# Altium schematic sheet TopAdapter.SchDoc
size A4
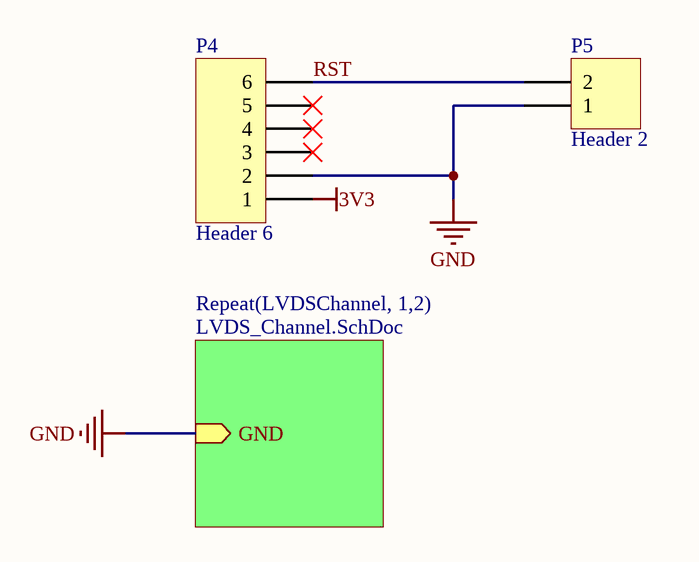
[diagram p0: TopAdapter.SchDoc]

## Parts
P4  Header 6  [HDR1X6]
P5  Header 2  [HDR1X2]

## Sub-sheets
Repeat(LVDSChannel, 1,2) = LVDS_Channel.SchDoc: GND (in)

## Nets
3V3: P4.1
GND: P4.2 P5.1 ; sheet Repeat(LVDSChannel, 1,2)/GND
RST: P4.6 P5.2

Not connected (* = marked no-connect by the designer): P4 3* 4* 5*

## Library data of the parts
P4 = Header 6: Header, 6-Pin; LatestRevisionDate: 17-Jul-2002; LatestRevisionNote: Re-released for DXP Platform.; Publisher: Altium Limited
P5 = Header 2: Header, 2-Pin; LatestRevisionDate: 17-Jul-2002; LatestRevisionNote: Re-released for DXP Platform.; Publisher: Altium Limited